# Altium schematic sheet STM32.SchDoc
size A3; SheetNumber: 1; SheetTotal: 1
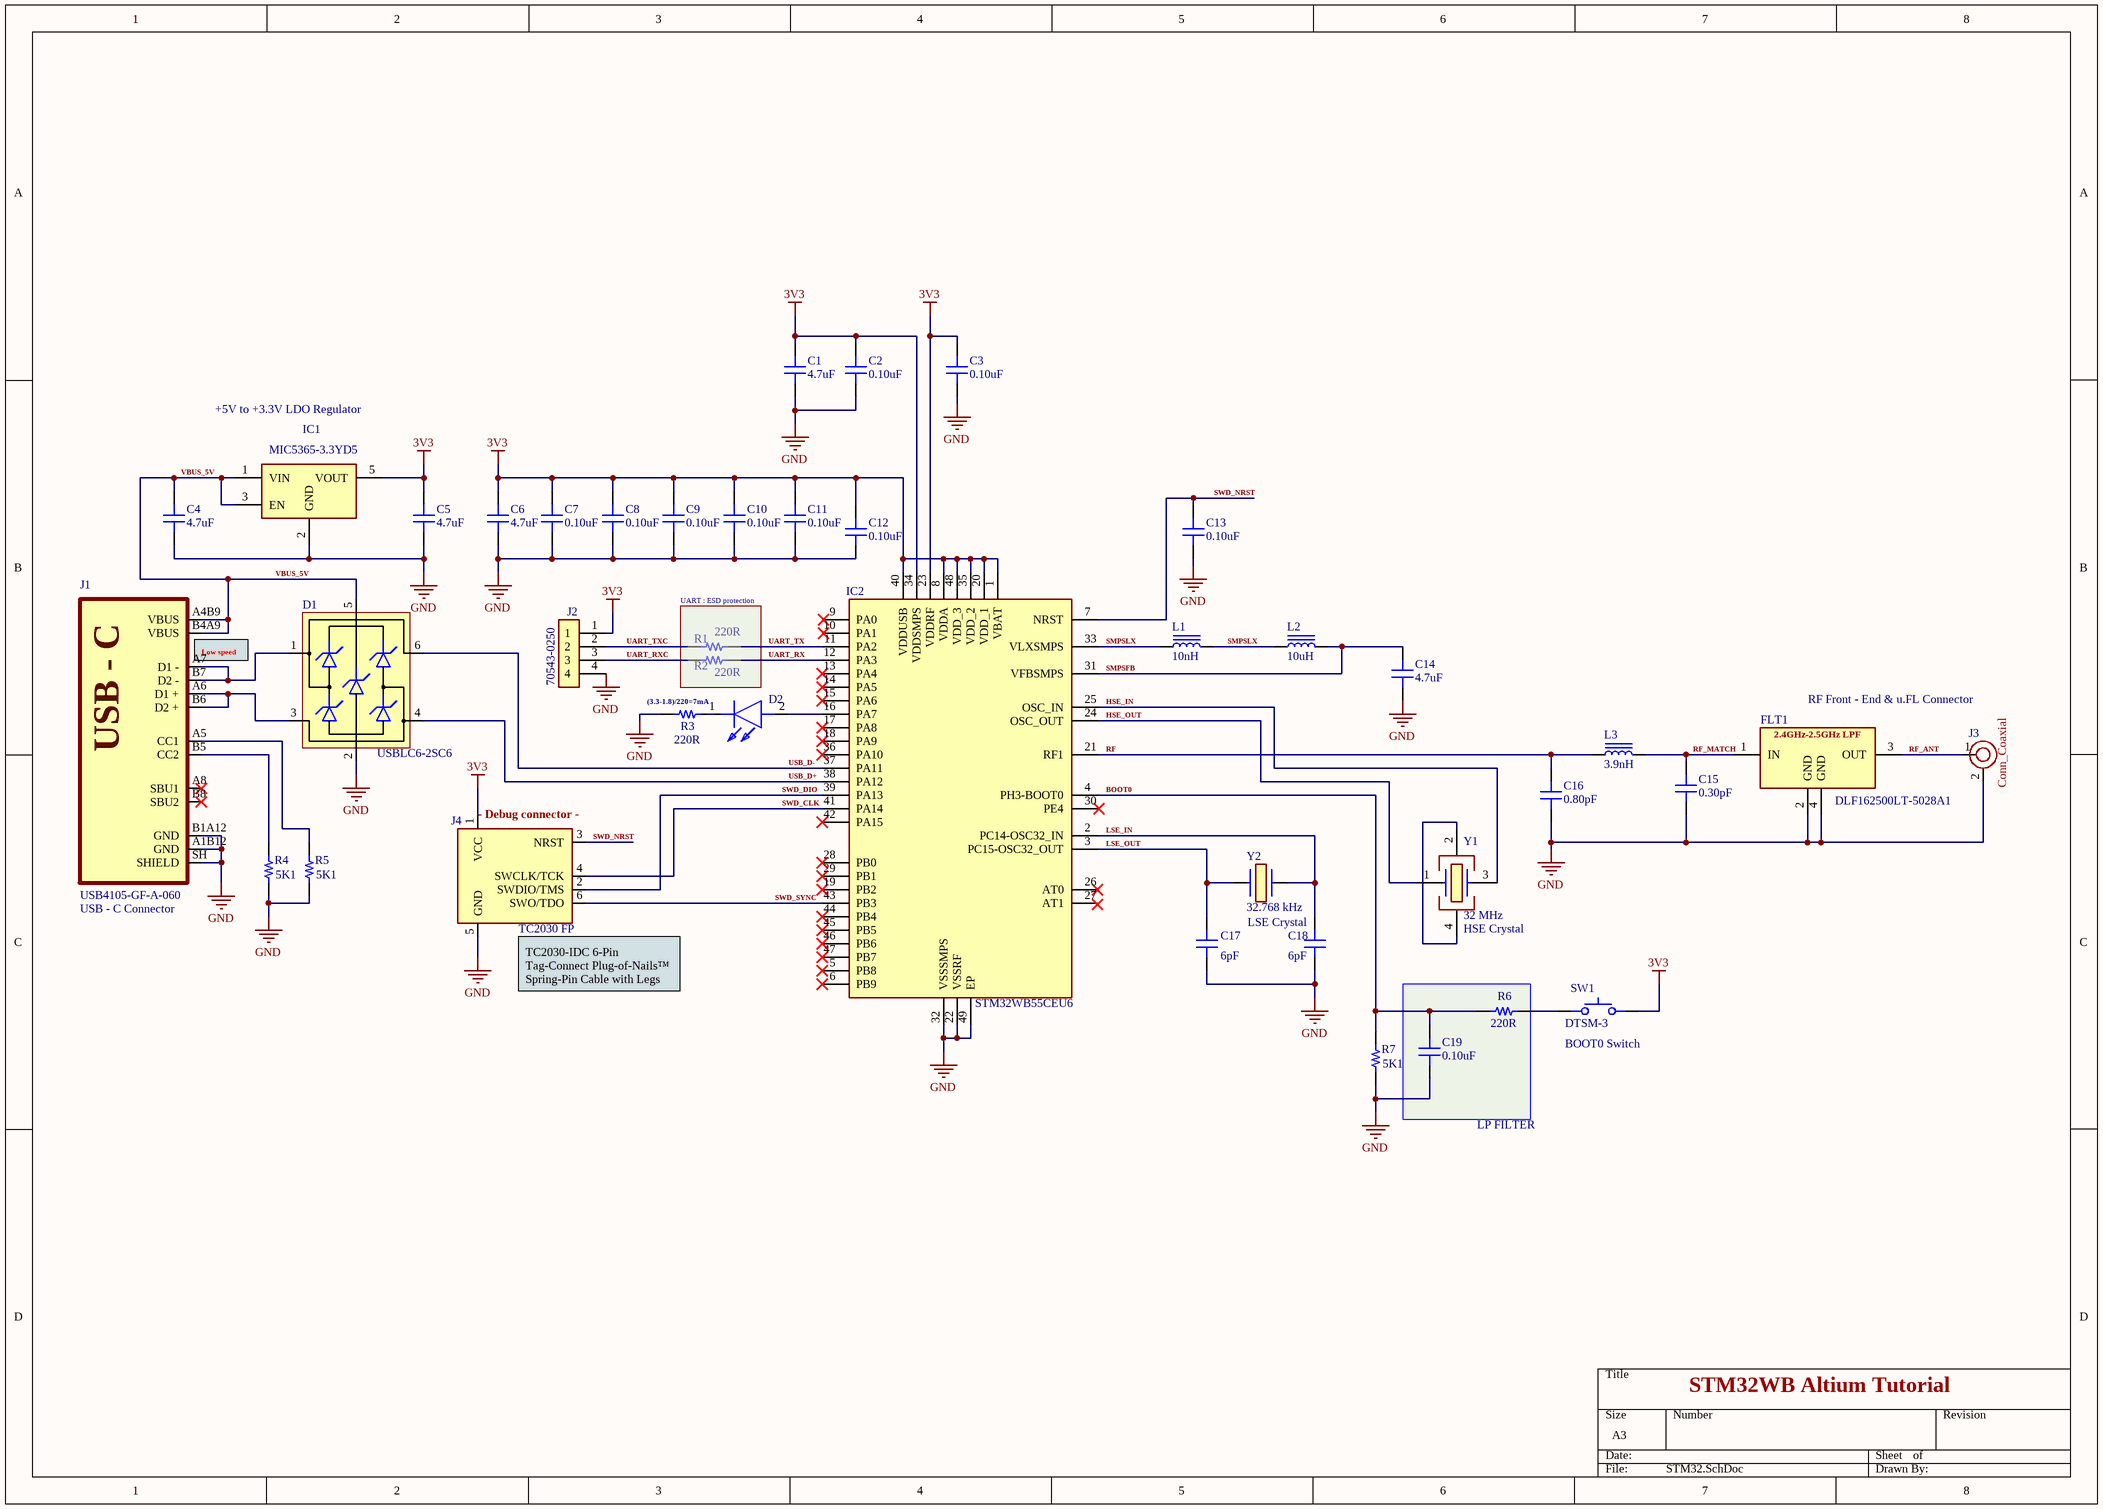
[diagram p0: STM32.SchDoc]

## Parts
C1  4.7uF  [CAP 0805/2012]
C2  0.10uF  [CAP 0402/1005]
C3  0.10uF  [CAP 0402/1005]
C4  4.7uF  [CAP 0805/2012]
C5  4.7uF  [CAP 0805/2012]
C6  4.7uF  [CAP 0805/2012]
C7  0.10uF  [CAP 0402/1005]
C8  0.10uF  [CAP 0402/1005]
C9  0.10uF  [CAP 0402/1005]
C10  0.10uF  [CAP 0402/1005]
C11  0.10uF  [CAP 0402/1005]
C12  0.10uF  [CAP 0402/1005]
C13  0.10uF  [CAP 0402/1005]
C14  4.7uF  [CAP 0805/2012]
C15  0.30pF  [CAP 0201/0603 RF]
C16  0.80pF  [CAP 0402/1005 RF]
C17  6pF  [CAP 0201/0603]
C18  6pF  [CAP 0201/0603]
C19  0.10uF  [CAP 0402/1005]
D1  USBLC6-2SC6  [SOT-23-6]
D2  150060GS55040  [LEDC1608X50N]  (value not drawn)
FLT1  DLF162500LT-5028A1  [DLF162500LT5028A1]
IC1  MIC5365-3.3YD5  [SOT95P280X100-5N]
IC2  STM32WB55CEU6  [QFN50P700X700X65-49N-D]
J1  USB4105-GF-A-060  [USB4105-GF-A-060]
J2  70543-0250  [705430250]
J3  Conn_Coaxial  [CON-SMA-EDGE-S]
J4  TC2030 FP  [TC2030-FP]  (no BOM)
L1  10nH  [IND 0402/1005 RF WW]
L2  10uH  [TDK VLS252012HBX-1]
L3  3.9nH  [LQG15WH0N7B02D]
R1  220R  [RES 0603/1608]
R2  220R  [RES 0603/1608]
R3  220R  [RES 0603/1608]
R4  5K1  [RES 0603/1608]
R5  5K1  [RES 0603/1608]
R6  220R  [RES 0603/1608]
R7  5K1  [RES 0603/1608]
SW1  DTSM-3  [DTSM-3]
Y1  32 MHz  [7B32000MAAJT]
Y2  32.768 kHz  [ABM3]

## Blocks framed on the sheet
UART : ESD protection: R1 R2

## Nets
3V3: C1.2 C2.2 C3.2 C5.2 C6.2 C7.2 C8.2 C9.2 C10.2 C11.2 C12.2 IC1.5(VOUT) IC2.1(VBAT) IC2.8(VDDA) IC2.20(VDD_1) IC2.23(VDDRF) IC2.34(VDDSMPS) IC2.35(VDD_2) IC2.40(VDDUSB) IC2.48(VDD_3) J2.1 J4.1(VCC) SW1.2
GND: C1.1 C2.1 C3.1 C4.1 C5.1 C6.1 C7.1 C8.1 C9.1 C10.1 C11.1 C12.1 C13.1 C14.1 C15.1 C16.1 C17.1 C18.2 C19.1 D1.2(GND) FLT1.2(GND) FLT1.4(GND) IC1.2(GND) IC2.22(VSSRF) IC2.32(VSSSMPS) IC2.49(EP) J1.A1B12(GND) J1.B1A12(GND) J1.SH(SHIELD) J2.4 J3.2 J4.5(GND) R3.1 R4.1 R5.1 R7.1
BOOT0: C19.2 IC2.4(PH3-BOOT0) R6.1 R7.2
HSE_IN: IC2.25(OSC_IN) Y1.3(CRYSTAL_2)
HSE_OUT: IC2.24(OSC_OUT) Y1.1(CRYSTAL_1)
LSE_IN: C18.1 IC2.2(PC14-OSC32_IN) Y2.2
LSE_OUT: C17.2 IC2.3(PC15-OSC32_OUT) Y2.1
RF: C16.2 IC2.21(RF1) L3.1
RF_ANT: FLT1.3(OUT) J3.1
RF_MATCH: C15.2 FLT1.1(IN) L3.2
SMPSFB: C14.2 IC2.31(VFBSMPS) L2.2
SMPSLX: IC2.33(VLXSMPS) L1.1 L1.2 L2.1
SWD_CLK: IC2.41(PA14) J4.4(SWCLK/TCK)
SWD_DIO: IC2.39(PA13) J4.2(SWDIO/TMS)
SWD_NRST: C13.2 IC2.7(NRST) J4.3(NRST)
SWD_SYNC: IC2.43(PB3) J4.6(SWO/TDO)
UART_RX: IC2.12(PA3) R2.2
UART_RXC: J2.3 R2.1
UART_TX: IC2.11(PA2) R1.2
UART_TXC: J2.2 R1.1
USB_D+: D1.4(IO2) IC2.38(PA12)
USB_D-: D1.6(IO1) IC2.37(PA11)
VBUS_5V: C4.2 D1.5(VBUS) IC1.1(VIN) IC1.3(EN) J1.A4B9(VBUS) J1.B4A9(VBUS)
NetD1_1: D1.1(IO1) J1.A7(D1_-) J1.B7(D2_-)
NetD1_3: D1.3(IO2) J1.A6(D1_+) J1.B6(D2_+)
NetD2_1: D2.1(K) R3.2
NetD2_2: D2.2(A) IC2.16(PA7)
NetJ1_A5: J1.A5(CC1) R5.2
NetJ1_B5: J1.B5(CC2) R4.2
NetR6_2: R6.2 SW1.1
NetY1_2: Y1.2(GND_1) Y1.4(GND_2)

Not connected (* = marked no-connect by the designer): IC2 5(PB8)* 6(PB9)* 9(PA0) 10(PA1) 13(PA4)* 14(PA5)* 15(PA6)* 17(PA8)* 18(PA9)* 19(PB2)* 26(AT0) 27(AT1) 28(PB0)* 29(PB1)* 30(PE4)* 36(PA10)* 42(PA15)* 44(PB4)* 45(PB5)* 46(PB6)* 47(PB7)*; J1 A8(SBU1)* B8(SBU2)*

## Notes on the sheet
- +5V to +3.3V LDO Regulator
- (near J1) Low speed
- (3.3-1.8)/220=7mA
- RF Front - End & u.FL Connector
- (near J4) - Debug connector -
- (near J1) USB - C Connector
- (near J4) TC2030-IDC 6-Pin  Tag-Connect Plug-of-Nails™ Spring-Pin Cable with Legs
- (near C18) LSE Crystal
- (near Y1) HSE Crystal
- (near SW1) BOOT0 Switch
- LP FILTER
- STM32WB Altium Tutorial
- Labels drawn without touching a wire or pin: SMPSLX
- (in symbol DLF162500LT-5028A1) 2.4GHz-2.5GHz LPF
- (in symbol USB4105-GF-A-060) USB - C

## Library data of the parts
C1 C4-C6 C14 = CL21B475KPFNNNE: CAP CER 4.7UF 10V X7R 0805; Manufacturer: Samsung Electro-Mechanics America, Inc.; TemperatureRange: -55C ~ 125C; Tolerance: 10%; Value: 4.7uF; Part Number: CL21B475KPFNNNE; PartId: 13993; Supplier 1: Digi-Key; Supplier Part Number 1: 1276-2972-2-ND; ComponentLink1Description: Datasheet; ComponentLink1URL: http://www.samsungsem.com/kr/support/product-search/mlcc/CL21B475KPFNNNE.jsp; ComponentLink2Description: Digi-Key Listing; ComponentLink2URL: https://www.digikey.com/product-detail/en/samsung-electro-mechanics-america-inc/CL21B475KPFNNNE/1276-2972-2-ND/3888630; TemperatureCoefficient: X7R; Voltage: 10V; Price: 0.0363; Device Package: 0805 (2012 Metric)
C2 C3 C7-C13 C19 = CL05B104KO5NFNC: CAP CER 0.1UF 16V X7R 0402; Manufacturer: Samsung Electro-Mechanics America, Inc.; TemperatureRange: -55C ~ 125C; Tolerance: 10%; Value: 0.10uF; Part Number: CL05B104KO5NFNC; PartId: 12572; Supplier 1: Digi-Key; Supplier Part Number 1: 1276-1508-2-ND; ComponentLink1Description: Datasheet; ComponentLink1URL: http://www.samsungsem.com/kr/support/product-search/mlcc/CL05B104KO5NFNC.jsp; ComponentLink2Description: Digi-Key Listing; ComponentLink2URL: https://www.digikey.com/product-detail/en/samsung-electro-mechanics-america-inc/CL05B104KO5NFNC/1276-1508-2-ND/3887166; TemperatureCoefficient: X7R; Voltage: 16V; Price: 0.0021; Device Package: 0402 (1005 Metric)
C15 = 250R05L0R3BV4T: CAP CER 0.3PF 25V NP0 0201; Manufacturer: Johanson Technology Inc.; TemperatureRange: -55C ~ 125C; TemperatureCoefficient: C0G, NP0; Tolerance: 0.1pF; Value: 0.30pF; Part Number: 250R05L0R3BV4T; PartId: 21121; Supplier 1: Digi-Key; Supplier Part Number 1: 712-1466-2-ND; ComponentLink1Description: Datasheet; ComponentLink1URL: http://www.johansontechnology.com/downloads/JTI-CAT-MLCC-HighQ.pdf; ComponentLink2Description: Digi-Key Listing; ComponentLink2URL: https://www.digikey.com/product-detail/en/johanson-technology-inc/250R05L0R3BV4T/712-1466-2-ND/1916336; Voltage: 25V; Price: 0.01; Device Package: 0201 (0603 Metric)
C16 = GJM1555C1HR80BB01D: CAP CER 0.80PF 50V NP0 0402; Manufacturer: Murata Electronics North America; TemperatureRange: -55C ~ 125C; TemperatureCoefficient: C0G, NP0; Tolerance: 0.1pF; Type: High Q, Low Loss; Value: 0.80pF; Part Number: GJM1555C1HR80BB01D; PartId: 3740; Supplier 1: Digi-Key; Supplier Part Number 1: 490-6080-2-ND; ComponentLink1Description: Datasheet; ComponentLink1URL: http://www.murata.com/~/media/webrenewal/support/library/catalog/products/capacitor/mlcc/c02e.ashx; ComponentLink2Description: Digi-Key listing; ComponentLink2URL: http://digikey.com/product-detail/en/GJM1555C1HR80BB01D/490-6080-2-ND/2593264; Voltage: 50V; Price: 0.0393; Device Package: 0402 (1005 Metric)
C17 C18 = CL03C060BA3GNNC: CAP CER 6PF 25V NP0 0201; Manufacturer: Samsung Electro-Mechanics America, Inc.; TemperatureRange: -55C ~ 125C; TemperatureCoefficient: C0G, NP0; Tolerance: 0.1pF; Value: 6pF; Part Number: CL03C060BA3GNNC; PartId: 21085; Supplier 1: Digi-Key; Supplier Part Number 1: 1276-1369-2-ND; ComponentLink1Description: Datasheet; ComponentLink1URL: http://www.samsungsem.com/kr/support/product-search/mlcc/__icsFiles/afieldfile/2016/08/18/S_CL03C060BA3GNNC.pdf; ComponentLink2Description: Digi-Key Listing; ComponentLink2URL: https://www.digikey.com/product-detail/en/samsung-electro-mechanics-america-inc/CL03C060BA3GNNC/1276-1369-2-ND/3887027; Voltage: 25V; Price: 0.0063; Device Package: 0201 (0603 Metric)
D1 = USBLC6-2SC6: Low-Capacitance ESD Protection USB; Manufacturer: STMicroelectronics; Manufacturer Part Number: USBLC6-2SC6; Distributor Link: https://www.mouser.de/ProductDetail/STMicroelectronics/USBLC6-2SC6?qs=po45yt2pPpu%2FhNIlwQdTlg%3D%3D
D2 = 150060GS55040: LED SMD 0603 Green 520nm; Manufacturer_Name: Wurth Elektronik; Datasheet Link: https://katalog.we-online.de/led/datasheet/150060GS55040.pdf; Height: 0.5mm; Manufacturer_Part_Number: 150060GS55040; Mouser Part Number: 710-150060GS55040; Mouser Price/Stock: https://www.mouser.co.uk/ProductDetail/Wurth-Elektronik/150060GS55040?qs=fAHHVMwC%252Bbhr5Aln2oA6Nw%3D%3D
FLT1 = DLF162500LT-5028A1: LTCC Low Pass filter 2400-2500MHz; Manufacturer_Name: TDK; Datasheet Link: https://product.tdk.com/system/files/dam/doc/product/rf/rf/filter/catalog/rf_lpf_dlf162500lt-5028a1_en.pdf; Height: 0.4mm; Manufacturer_Part_Number: DLF162500LT-5028A1; Mouser Part Number: 810-DLF16250LT5028A1; Mouser Price/Stock: https://www.mouser.co.uk/ProductDetail/TDK/DLF162500LT-5028A1?qs=U%2FZX79kHR%2FlwIbAISCs3qA%3D%3D; Arrow Part Number: DLF162500LT-5028A1; Arrow Price/Stock: null?region=nac
IC1 = MIC5365-3.3YD5-TR: Integrated Circuit; Manufacturer_Name: Microchip; Datasheet Link: https://ww1.microchip.com/downloads/en/DeviceDoc/mic5365.pdf; Height: 1mm; Manufacturer_Part_Number: MIC5365-3.3YD5-TR; Mouser Part Number: 998-MIC5365-3.3YD5TR; Mouser Price/Stock: https://www.mouser.co.uk/ProductDetail/Microchip-Technology/MIC5365-3.3YD5-TR?qs=U6T8BxXiZAXzRinbbfZRrg%3D%3D; Arrow Part Number: MIC5365-3.3YD5-TR; Arrow Price/Stock: https://www.arrow.com/en/products/mic5365-3.3yd5-tr/microchip-technology?region=nac
IC2 = STM32WB55CEU6: MCU Ultra-low-power dual core Arm Cortex-M4 MCU 64 MHz, Cortex-M0+ 32 MHz 512 Kbytes, RF Microcontrollers; Manufacturer_Name: STMicroelectronics; Datasheet Link: https://www.st.com/resource/en/datasheet/stm32wb55rg.pdf; Height: 0.65mm; Manufacturer_Part_Number: STM32WB55CEU6; Mouser Part Number: 511-STM32WB55CEU6; Mouser Price/Stock: https://www.mouser.co.uk/ProductDetail/STMicroelectronics/STM32WB55CEU6?qs=l7cgNqFNU1h38DnIgipayw%3D%3D; Arrow Part Number: STM32WB55CEU6; Arrow Price/Stock: https://www.arrow.com/en/products/stm32wb55ceu6/stmicroelectronics?region=nac
J1 = USB4105-GF-A-060: USB Connector Type C SMT 12 Pin; Manufacturer: GCT; Manufacturer Part Number: USB4105-GF-A-060; Distributor Link: https://eu.mouser.com/ProductDetail/GCT/USB4105-GF-A-060?qs=QNEnbhJQKvY2mocwNJzgfA%3D%3D
J2 = 70543-0250: Connector 1X4 Headers & Wire Housings; Manufacturer_Name: Molex; Datasheet Link: https://www.molex.com/pdm_docs/sd/705430250_sd.pdf; Height: 11.94mm; Manufacturer_Part_Number: 70543-0250; Mouser Part Number: 538-70543-0250; Mouser Price/Stock: https://www.mouser.co.uk/ProductDetail/Molex/70543-0250?qs=kYQSPAH4sJy4tcb7Hig5SQ%3D%3D
J3 = CON-SMA-EDGE-S: RF Connector SMA Female 50 Ohms 18 GHz PCB Edge Mount; Manufacturer: RF Solutions; Manufacturer Part Number: CON-SMA-EDGE-S
J4 = TC2030: Tag-Connect No-Solder SWD Debug Connector DO NOT PLACE; Manufacturer: Tag-Connect; Manufacturer Part Number: TC2030
L1 = LQW15AN10NJ00D: FIXED IND 10NH 500MA 170 MOHM; Manufacturer: Murata Electronics North America; TemperatureRange: -55C ~ 125C; Tolerance: 5%; Type: Wirewound; Q at Frequency: 25 @ 250MHz; DC Resistance: 170 mOhm Max; Shielding: Unshielded; Value: 10nH; Part Number: LQW15AN10NJ00D; PartId: 6350; Supplier 1: Digi-Key; Supplier Part Number 1: 490-1146-2-ND; ComponentLink1Description: Datasheet; ComponentLink1URL: http://search.murata.co.jp/Ceramy/image/img/PDF/ENG/L0075S0080LQW15A_00.pdf; ComponentLink2Description: Digi-Key listing; ComponentLink2URL: http://digikey.com/product-detail/en/LQW15AN10NJ00D/490-1146-2-ND/584355; Price: 0.0689; Device Package: 0402 (1005 Metric)
L2 = VLS252012HBX-100M-1: FIXED IND 10UH 1A 540 MOHM SMD; Manufacturer: TDK Corporation; Type: Wirewound; Tolerance: 20%; Shielding: Shielded; DC Resistance (DCR): 540 mOhm Max; Value: 10uH; Part Number: VLS252012HBX-100M-1; PartId: 9578; Supplier 1: Digi-Key; Supplier Part Number 1: 445-173024-1-ND; ComponentLink1Description: Datasheet; ComponentLink1URL: https://product.tdk.com/info/en/catalog/datasheets/inductor_commercial_power_vls252012hbx-1_en.pdf; ComponentLink2Description: Digi-Key Listing; ComponentLink2URL: https://www.digikey.com/product-detail/en/VLS252012HBX-100M-1/445-173024-1-ND/5250943; Price: 0.75; Device Package: 1008 (2520 Metric); Series: VLS-HBX-1; Inductance: 10uH; Current Rating: 1A; Q @ Freq: -; Frequency - Self Resonant: -; Operating Temperature: -40C ~ 105C
L3 = LQG15HS2N7S02D: FIXED IND 2.7NH 800MA 0.15OHM SM; Part Number: LQW15AN3N9D10D; Manufacturer: Murata Electronics North America; TemperatureRange: -55C ~ 125C; Tolerance: 0.5nH; Type: Wirewound; Q at Frequency: 30 @ 250MHz; DC Resistance: 40 mOhm Max; Shielding: Unshielded; Value: 3.9nH; PartId: 6435; Supplier 1: Digi-Key; Supplier Part Number 1: 490-6815-2-ND; ComponentLink1Description: Datasheet; ComponentLink1URL: http://search.murata.co.jp/Ceramy/image/img/PDF/ENG/L0075S0080LQW15A_10.pdf; ComponentLink2Description: Digi-Key listing; ComponentLink2URL: http://digikey.com/product-detail/en/LQW15AN3N9D10D/490-6815-2-ND/2594912; Price: 0.0843; Device Package: 0402 (1005 Metric)
R1-R3 R6 = 0603S8J0221: RES SMD 220R OHM 5% 1/8W 0603; Manufacturer: Uniohm; TemperatureRange: -55C ~ 155C; TemperatureCoefficient: 100ppm/C; PowerRating: 0.125W, 1/8W; Value: 220R; Part Number: 0603S8J0221; Tolerance: 5%; Price: 0.0089; Device Package: 1608 (0603 Metric)
R4 R5 R7 = 0603S8J0512: RES SMD 5K1 OHM 5% 1/8W 0603; Manufacturer: Uniohm; TemperatureRange: -55C ~ 155C; TemperatureCoefficient: 100ppm/C; PowerRating: 0.125W, 1/8W; Value: 5K1; Part Number: 0603S8J0512; Tolerance: 5%; Price: 0.0089; Device Package: 1608 (0603 Metric)
SW1 = DTSM-3: Tactile Switch SMD SPST; Manufacturer: Diptronics; Manufacturer Part Number: DTSM-3
Y1 = 7B-32.000MAAJ-T: Crystals 32.000MHz 30ppm -20 +70C 18pF Crystal Oscillator; Manufacturer_Name: TXC CORPORATION; Manufacturer_Part_Number: 7B-16.000MAAJ-T; Datasheet Link: https://componentsearchengine.com/Datasheets/2/7B-16.000MAAJ-T.pdf; Height: 1.05mm; Mouser Part Number: 717-7B-16.000MAAJ-T; Mouser Price/Stock: https://www.mouser.com/Search/Refine.aspx?Keyword=717-7B-16.000MAAJ-T; Arrow Part Number: 7B-16.000MAAJ-T; Arrow Price/Stock: https://www.arrow.com/en/products/7b-16.000maaj-t/txc-corporation
Y2 = ABS07-32.768KHZ-6-T: Crystal Oscillator 32.768 kHz ±10ppm 6pF 50 KOhms Crystal or Oscillator; Manufacturer_Name: ABRACON; Manufacturer_Part_Number: ABM316000MHZB2T; Datasheet Link: https://abracon.com/Resonators/abm3.pdf; Height: 1.3mm